# Altium schematic sheet FMC.SchDoc: WR_Cute_Carrier
size A4; Author: G.Kasprowicz; CompanyName: WUT ISE; DrawnBy: G.Kasprowicz; Organization: WUT ISE; Address1: PW ISE; Address2: Nowowiejska 15/19 00-665 Warsaw; Address3: gkasprow@gmail.com; DocumentNumber: 2; Revision: 2; SheetNumber: 2; SheetTotal: 7; ModifiedBy: -; CheckedDate: -; Title2: FMC; DivGrp: WUT ISE; Designer: G.Kasprowicz; ModifiedDate: -; ProjectName: Sensor Box
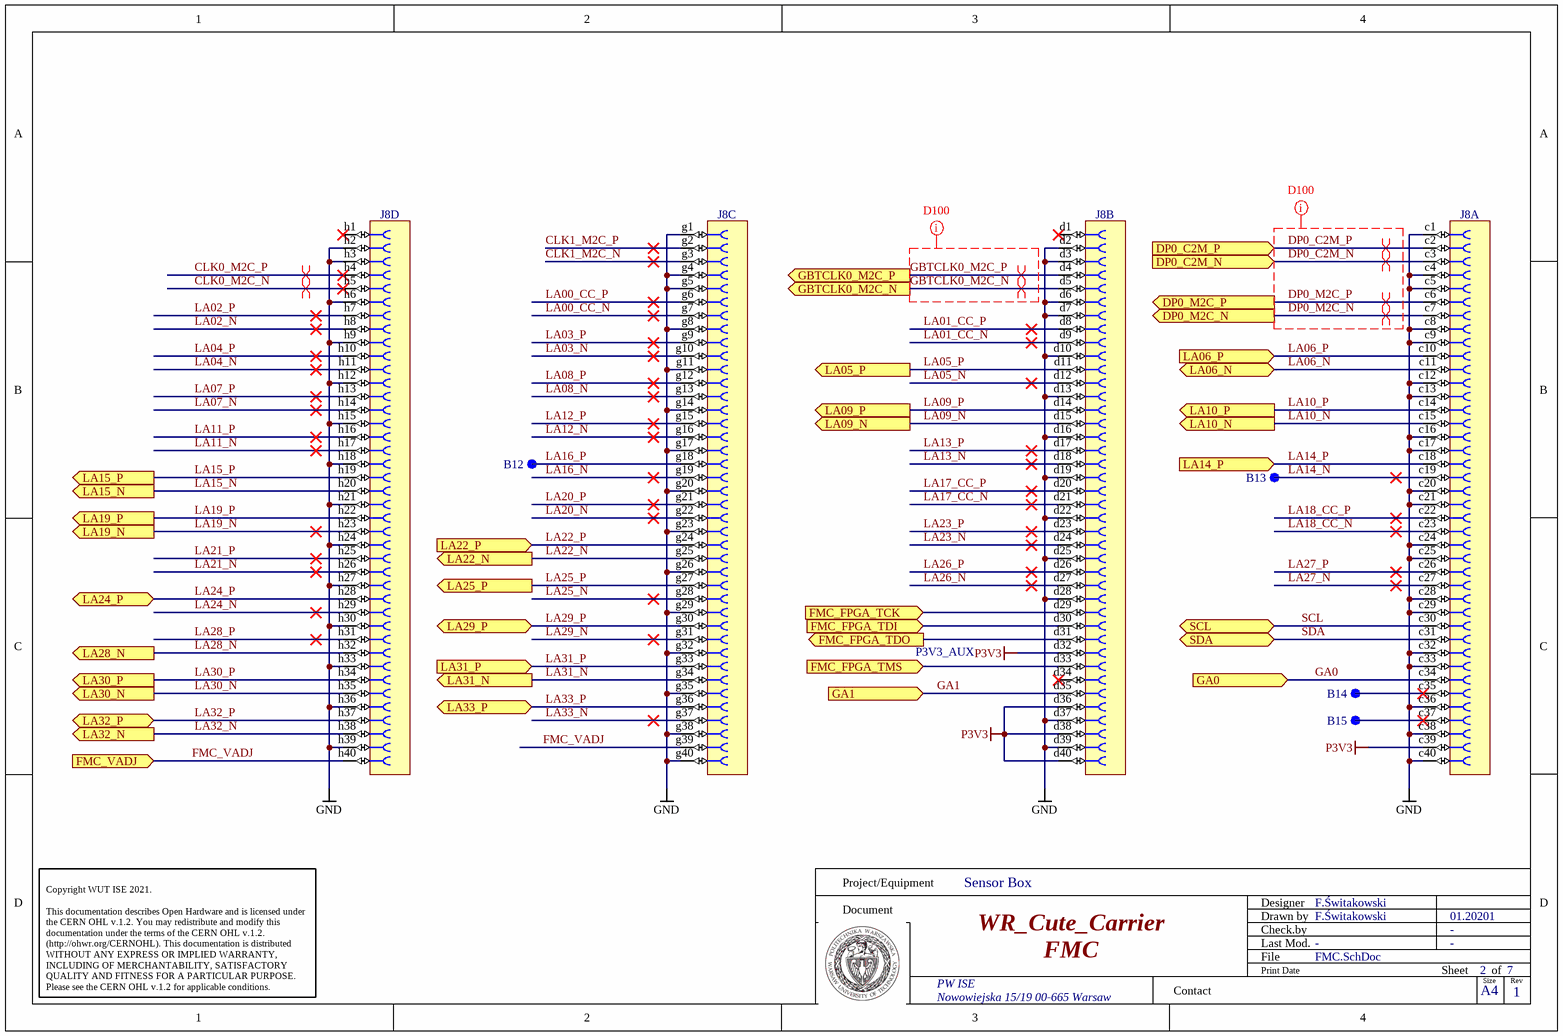
[diagram p0: FMC.SchDoc]

## Parts
B12  SMD Pad  [C100]  (value not drawn)  (no BOM)
B13  SMD Pad  [C100]  (value not drawn)  (no BOM)
B14  SMD Pad  [C100]  (value not drawn)  (no BOM)
B15  SMD Pad  [C100]  (value not drawn)  (no BOM)
J8  VITA 57  [SAMTEC_ASP-134603-01]  (value not drawn)  (parts A,B,C,D of 4)

## Ports
DP0_C2M_N (in), DP0_C2M_P (in), DP0_M2C_N (out), DP0_M2C_P (out), FMC_FPGA_TCK (in), FMC_FPGA_TDI (in), FMC_FPGA_TDO (out), FMC_FPGA_TMS (in), FMC_VADJ (in), GA0 (in), GA1 (in), GBTCLK0_M2C_N (out), GBTCLK0_M2C_P (out), LA05_P (out), LA06_N (bidir), LA06_P (in), LA09_N (out), LA09_P (out), LA10_N (out), LA10_P (out), LA14_P (in), LA15_N (out), LA15_P (out), LA19_N (out), LA19_P (out), LA22_N (out), LA22_P (in), LA24_P (bidir), LA25_P (out), LA28_N (out), LA29_P (bidir), LA30_N (out), LA30_P (out), LA31_N (out), LA31_P (in), LA32_N (out), LA32_P (bidir), LA33_P (bidir), SCL (bidir), SDA (bidir)

## Nets
GND: J8.c1 J8.c4 J8.c5 J8.c8 J8.c9 J8.c12 J8.c13 J8.c16 J8.c17 J8.c20 J8.c21 J8.c24 J8.c25 J8.c28 J8.c29 J8.c32 J8.c33 J8.c36 J8.c38 J8.c40 J8.d2 J8.d3 J8.d6 J8.d7 J8.d10 J8.d13 J8.d16 J8.d19 J8.d22 J8.d25 J8.d28 J8.d37 J8.d39 J8.g1 J8.g4 J8.g5 J8.g8 J8.g11 J8.g14 J8.g17 J8.g20 J8.g23 J8.g26 J8.g29 J8.g32 J8.g35 J8.g38 J8.g40 J8.h2 J8.h3 J8.h6 J8.h9 J8.h12 J8.h15 J8.h18 J8.h21 J8.h24 J8.h27 J8.h30 J8.h33 J8.h36 J8.h39
P3V3: J8.c39 J8.d32 J8.d36 J8.d38 J8.d40
CLK0_M2C_N: J8.h5
CLK0_M2C_P: J8.h4
CLK1_M2C_N: J8.g3
CLK1_M2C_P: J8.g2
DP0_C2M_N: J8.c3 ; port DP0_C2M_N
DP0_C2M_P: J8.c2 ; port DP0_C2M_P
DP0_M2C_N: J8.c7 ; port DP0_M2C_N
DP0_M2C_P: J8.c6 ; port DP0_M2C_P
FMC_FPGA_TCK: J8.d29 ; port FMC_FPGA_TCK
FMC_FPGA_TDI: J8.d30 ; port FMC_FPGA_TDI
FMC_FPGA_TDO: J8.d31 ; port FMC_FPGA_TDO
FMC_FPGA_TMS: J8.d33 ; port FMC_FPGA_TMS
FMC_VADJ: J8.g39 J8.h40 ; port FMC_VADJ
GA0: J8.c34 ; port GA0
GA1: J8.d35 ; port GA1
GBTCLK0_M2C_N: J8.d5 ; port GBTCLK0_M2C_N
GBTCLK0_M2C_P: J8.d4 ; port GBTCLK0_M2C_P
LA00_CC_N: J8.g7
LA00_CC_P: J8.g6
LA01_CC_N: J8.d9
LA01_CC_P: J8.d8
LA02_N: J8.h8
LA02_P: J8.h7
LA03_N: J8.g10
LA03_P: J8.g9
LA04_N: J8.h11
LA04_P: J8.h10
LA05_N: J8.d12
LA05_P: J8.d11 ; port LA05_P
LA06_N: J8.c11 ; port LA06_N
LA06_P: J8.c10 ; port LA06_P
LA07_N: J8.h14
LA07_P: J8.h13
LA08_N: J8.g13
LA08_P: J8.g12
LA09_N: J8.d15 ; port LA09_N
LA09_P: J8.d14 ; port LA09_P
LA10_N: J8.c15 ; port LA10_N
LA10_P: J8.c14 ; port LA10_P
LA11_N: J8.h17
LA11_P: J8.h16
LA12_N: J8.g16
LA12_P: J8.g15
LA13_N: J8.d18
LA13_P: J8.d17
LA14_N: B13.1 J8.c19
LA14_P: J8.c18 ; port LA14_P
LA15_N: J8.h20 ; port LA15_N
LA15_P: J8.h19 ; port LA15_P
LA16_N: J8.g19
LA16_P: B12.1 J8.g18
LA17_CC_N: J8.d21
LA17_CC_P: J8.d20
LA18_CC_N: J8.c23
LA18_CC_P: J8.c22
LA19_N: J8.h23 ; port LA19_N
LA19_P: J8.h22 ; port LA19_P
LA20_N: J8.g22
LA20_P: J8.g21
LA21_N: J8.h26
LA21_P: J8.h25
LA22_N: J8.g25 ; port LA22_N
LA22_P: J8.g24 ; port LA22_P
LA23_N: J8.d24
LA23_P: J8.d23
LA24_N: J8.h29
LA24_P: J8.h28 ; port LA24_P
LA25_N: J8.g28
LA25_P: J8.g27 ; port LA25_P
LA26_N: J8.d27
LA26_P: J8.d26
LA27_N: J8.c27
LA27_P: J8.c26
LA28_N: J8.h32 ; port LA28_N
LA28_P: J8.h31
LA29_N: J8.g31
LA29_P: J8.g30 ; port LA29_P
LA30_N: J8.h35 ; port LA30_N
LA30_P: J8.h34 ; port LA30_P
LA31_N: J8.g34 ; port LA31_N
LA31_P: J8.g33 ; port LA31_P
LA32_N: J8.h38 ; port LA32_N
LA32_P: J8.h37 ; port LA32_P
LA33_N: J8.g37
LA33_P: J8.g36 ; port LA33_P
SCL: J8.c30 ; port SCL
SDA: J8.c31 ; port SDA
NetB14_1: B14.1 J8.c35
NetB15_1: B15.1 J8.c37

Not connected (* = marked no-connect by the designer): J8 d1* d34* h1*

## Layout directives
differential pair: CLK0_M2C_N, CLK0_M2C_P, DP0_C2M_N, DP0_C2M_P, DP0_M2C_N, DP0_M2C_P, GBTCLK0_M2C_N, GBTCLK0_M2C_P
net class D100: DP0_C2M_N, DP0_C2M_P, DP0_M2C_N, DP0_M2C_P, GBTCLK0_M2C_N, GBTCLK0_M2C_P

## Notes on the sheet
- P3V3_AUX
- Project/Equipment
- Document
- Designer
- Drawn by
- Check.by
- F.Świtakowski
- 01.20201
- PW ISE
- Contact
- File
- Last Mod.
- Print Date
- Sheet
- Size
- A4
- of
- 1
- Rev
- Copyright WUT ISE 2021.
  This documentation describes Open Hardware and is licensed under the CERN OHL v.1.2. You may redistribute and modify this documentation under the terms of the CERN OHL v.1.2. (http://ohwr.org/CERNOHL). This documentation is distributed WITHOUT ANY EXPRESS OR IMPLIED WARRANTY, INCLUDING OF MERCHANTABILITY, SATISFACTORY QUALITY AND FITNESS FOR A PARTICULAR PURPOSE. Please see the CERN OHL v.1.2 for applicable conditions.
- Nowowiejska 15/19 00-665 Warsaw

## Library data of the parts
B12-B15 = SMD_PAD_D1MM: Through Hole Pad; Part Description: 1mm Diameter SMD Pad; Mounted: No; Part Number: SMD_PAD_D1MM; Component Type: Standard (No BOM); Pin Count: 1; Family: SMD Pad; Socket: No; SMD: No; Sense: No; Status: None; ComponentHeight: 0mm; HelpURL: Undefined; Author: CERN DEM JLC; CreateDate: 10.10.2017; LatestRevisionDate: 10.10.2017; PackageDescription: 1mm Diameter SMD Pad
J8 = SAMTEC_ASP-134603-01: Connector VITA 57, 160 Female contacts in 4 row cdgh; Part Description: 160 contacts (4 rows cdgh) Surface Mount Female Connector, VITA 57 (CC-LPC-10); Manufacturer: SAMTEC; PressFit: No; Part Number: SAMTEC_ASP-134603-01; Component Kind: Standard; Component Type: Standard; Pin Count: 160; Family: VITA 57; Mounted: Yes; Socket: No; SMD: Yes; Sense: No; Status: None; Manufacturer Part Number: ASP-134603-01; ComponentHeight: 6.55mm; HelpURL: \\cern.ch\dfs\Applications\Altium\Datasheets\SAMTEC_ASP-134603-01.pdf; Author: CERN DEM JLC; CreateDate: 13.07.2010; LatestRevisionDate: 13.07.2010